# Altium schematic sheet edge_dff_rst_active.SchDoc
size A4
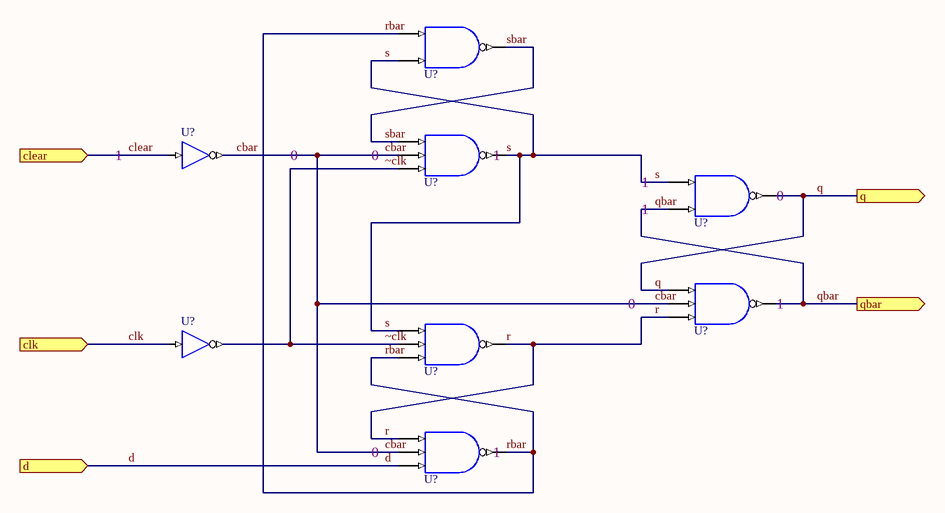
[diagram p0: edge_dff_rst_active.SchDoc]

## Parts
(Parts that share a designator on the sheet are numbered #1, #2 ... from top to bottom, then left to right.)
U?#1  AND 2  (value not drawn)
U?#2  NAND_3  (value not drawn)
U?#3  BUF_inv  (value not drawn)
U?#4  AND 2  (value not drawn)
U?#5  NAND_3  (value not drawn)
U?#6  NAND_3  (value not drawn)
U?#7  BUF_inv  (value not drawn)
U?#8  NAND_3  (value not drawn)

## Ports
clear (in), clk (in), d (in), q (out), qbar (out)

## Nets
cbar: U?#2.B U?#3.O U?#5.B U?#8.B
clear: U?#3.I ; port clear
clk: U?#7.I ; port clk
d: U?#8.C ; port d
q: U?#4.Y U?#5.A ; port q
qbar: U?#4.B U?#5.Y ; port qbar
r: U?#5.C U?#6.Y U?#8.A
rbar: U?#1.A U?#6.C U?#8.Y
s: U?#1.B U?#2.Y U?#4.A U?#6.A
sbar: U?#1.Y U?#2.A
~clk: U?#2.C U?#6.B U?#7.O

## Notes on the sheet
- 1
- 0
- (near U?#2) 0
- (near U?#2) 1
- (near U?#4) 1
- (near U?#4) 0
- (near U?#5) 1
- (near U?#8) 0
- (near U?#8) 1

## Library data of the parts
U?#1 U?#4 = AND_2: 2 Input AND
U?#2 U?#5 U?#6 U?#8 = NAND_3: 3 Input NAND 1 Not
U?#3 U?#7 = BUF_inv: 1-bit General Purpose (Non-inverting) Buffer